# Altium project mod_duo_dwarf.PrjPcb (part 2 of 2)

## Sheet [4]-MECH_BUTTONS.SchDoc: [4]-MECH_BUTTONS
size A3; DocumentNumber: 4; Revision: 01-01-2020; SheetNumber: 4; SheetTotal: 6
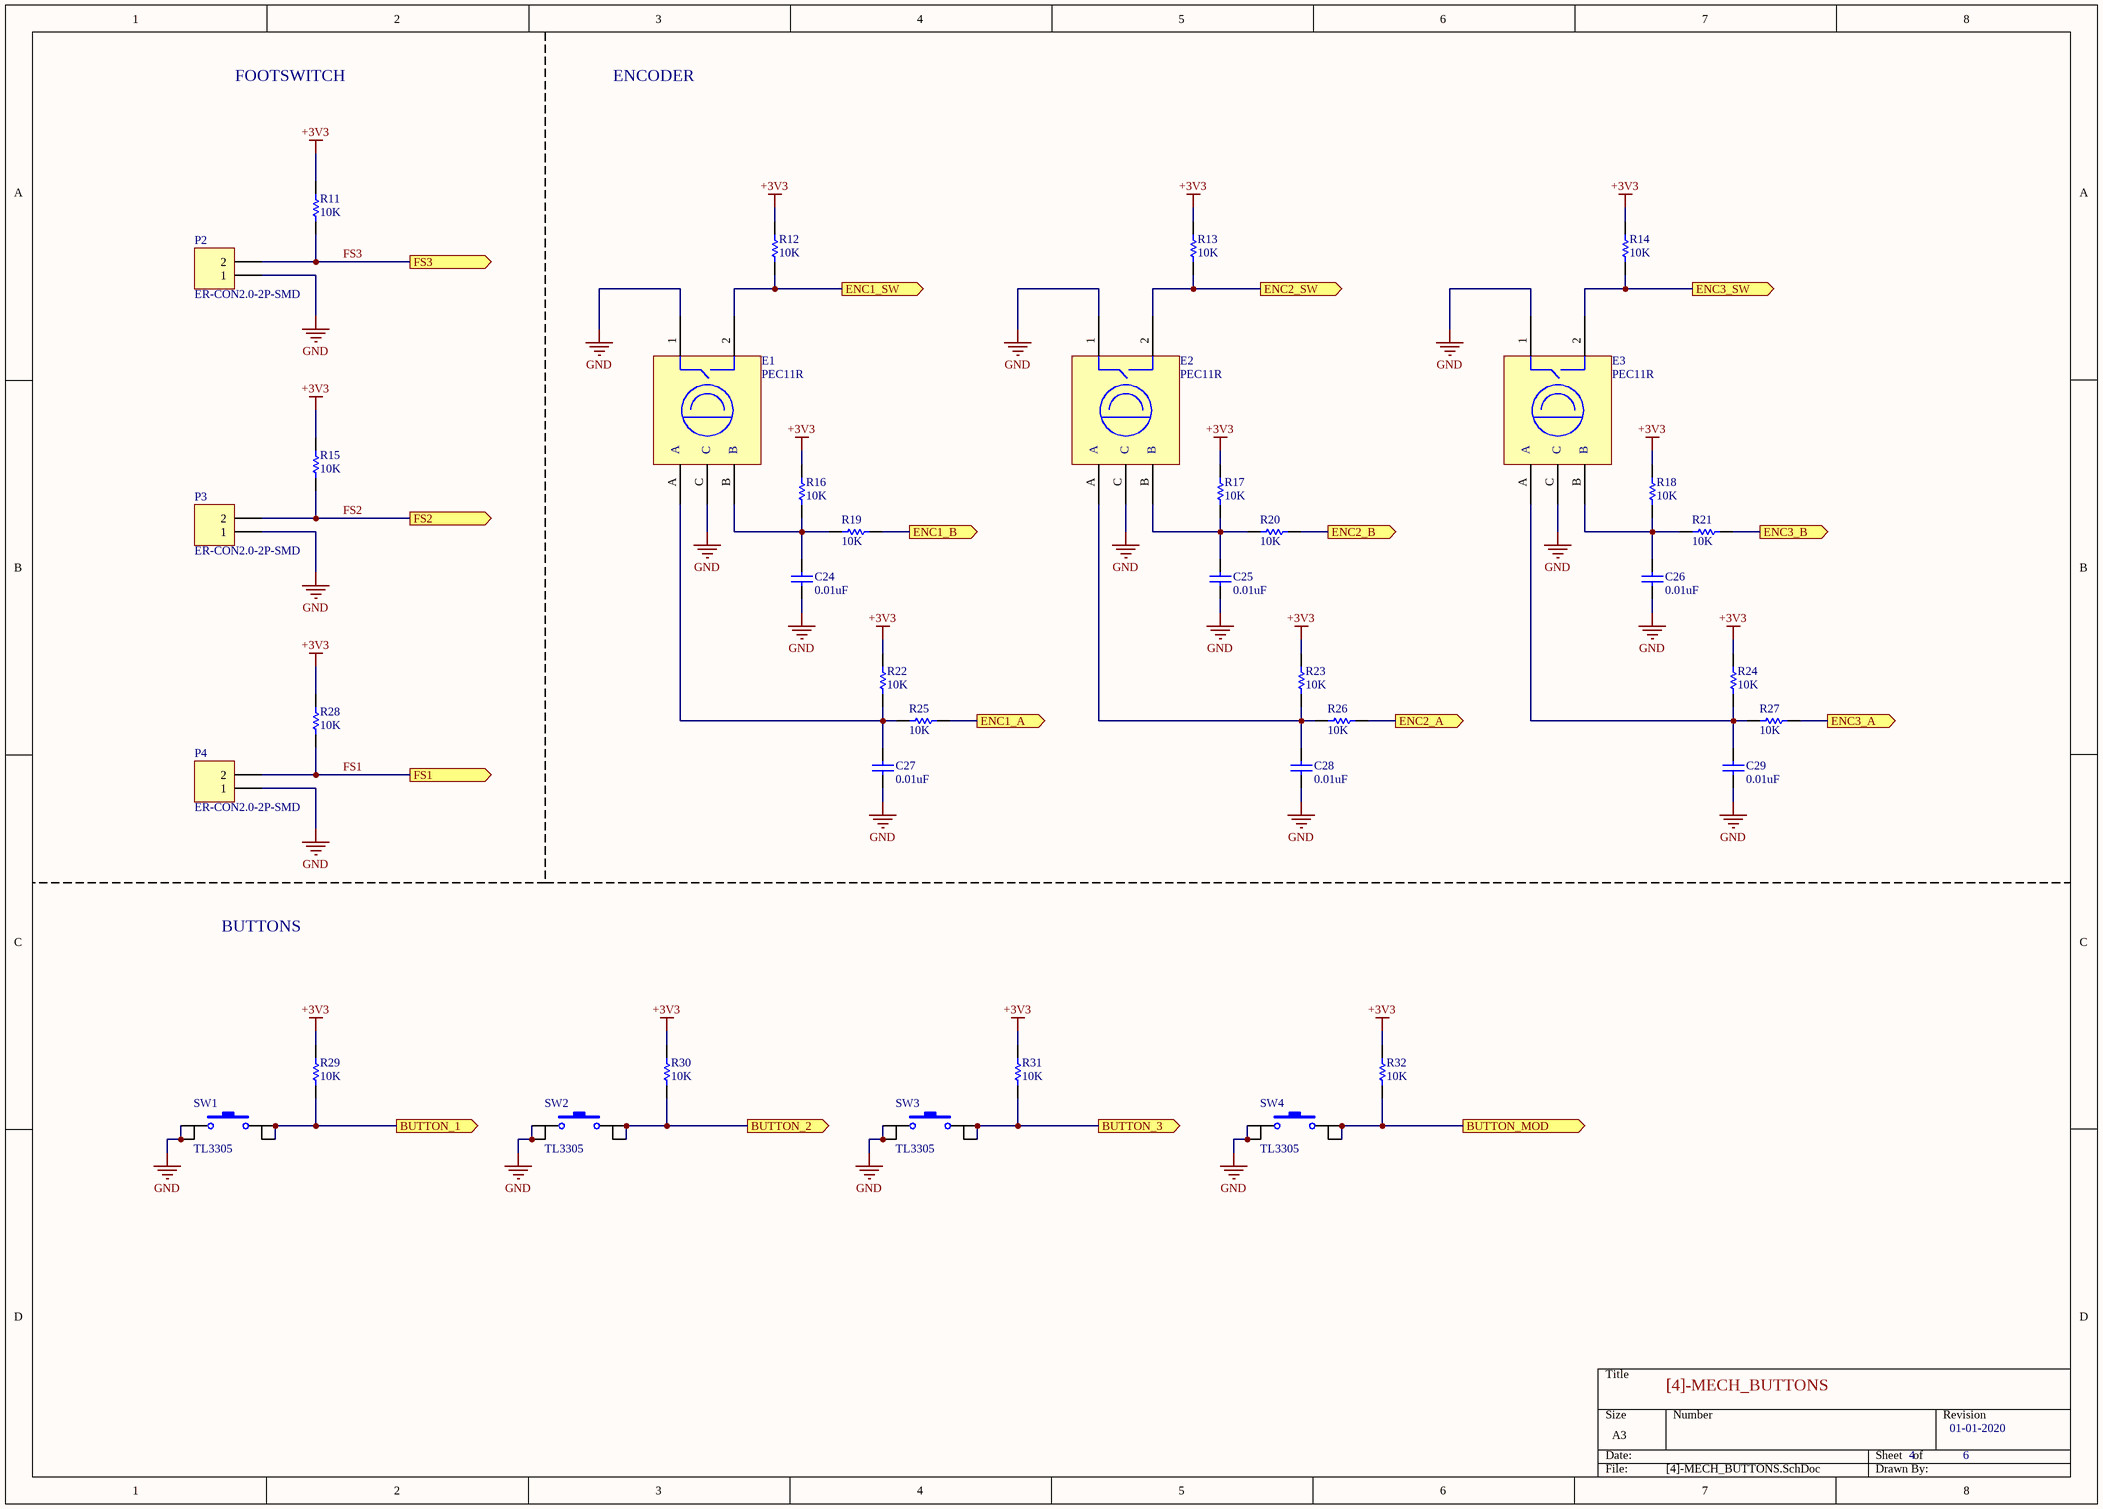
[diagram p3: [4]-MECH_BUTTONS.SchDoc]

### Parts
C24  0.01uF  [CAPC1608N]
C25  0.01uF  [CAPC1608N]
C26  0.01uF  [CAPC1608N]
C27  0.01uF  [CAPC1608N]
C28  0.01uF  [CAPC1608N]
C29  0.01uF  [CAPC1608N]
E1  PEC11R  [PEC11R]
E2  PEC11R  [PEC11R]
E3  PEC11R  [PEC11R]
P2  ER-CON2.0-2P-SMD  [ER-CON2.0-2P-SMD]
P3  ER-CON2.0-2P-SMD  [ER-CON2.0-2P-SMD]
P4  ER-CON2.0-2P-SMD  [ER-CON2.0-2P-SMD]
R11  10K  [RESC1608N]
R12  10K  [RESC1608N]
R13  10K  [RESC1608N]
R14  10K  [RESC1608N]
R15  10K  [RESC1608N]
R16  10K  [RESC1608N]
R17  10K  [RESC1608N]
R18  10K  [RESC1608N]
R19  10K  [RESC1608N]
R20  10K  [RESC1608N]
R21  10K  [RESC1608N]
R22  10K  [RESC1608N]
R23  10K  [RESC1608N]
R24  10K  [RESC1608N]
R25  10K  [RESC1608N]
R26  10K  [RESC1608N]
R27  10K  [RESC1608N]
R28  10K  [RESC1608N]
R29  10K  [RESC1608N]
R30  10K  [RESC1608N]
R31  10K  [RESC1608N]
R32  10K  [RESC1608N]
SW1  TL3305  [TL3305]
SW2  TL3305  [TL3305]
SW3  TL3305  [TL3305]
SW4  TL3305  [TL3305]

### Ports
BUTTON_1 (out), BUTTON_2 (out), BUTTON_3 (out), BUTTON_MOD (out), ENC1_A (out), ENC1_B (out), ENC1_SW (out), ENC2_A (out), ENC2_B (out), ENC2_SW (out), ENC3_A (out), ENC3_B (out), ENC3_SW (out), FS1 (out), FS2 (out), FS3 (out)

### Nets
+3V3: R11.1 R12.2 R13.2 R14.2 R15.1 R16.2 R17.2 R18.2 R22.2 R23.2 R24.2 R28.1 R29.2 R30.2 R31.2 R32.2
GND: C24.1 C25.1 C26.1 C27.1 C28.1 C29.1 E1.1 E1.C E2.1 E2.C E3.1 E3.C P2.1 P3.1 P4.1 SW1.1 SW1.2 SW2.1 SW2.2 SW3.1 SW3.2 SW4.1 SW4.2
BUTTON_1: R29.1 SW1.3 SW1.4 ; port BUTTON_1
BUTTON_2: R30.1 SW2.3 SW2.4 ; port BUTTON_2
BUTTON_3: R31.1 SW3.3 SW3.4 ; port BUTTON_3
BUTTON_MOD: R32.1 SW4.3 SW4.4 ; port BUTTON_MOD
ENC1_A: R25.1 ; port ENC1_A
ENC1_B: R19.1 ; port ENC1_B
ENC1_SW: E1.2 R12.1 ; port ENC1_SW
ENC2_A: R26.1 ; port ENC2_A
ENC2_B: R20.1 ; port ENC2_B
ENC2_SW: E2.2 R13.1 ; port ENC2_SW
ENC3_A: R27.1 ; port ENC3_A
ENC3_B: R21.1 ; port ENC3_B
ENC3_SW: E3.2 R14.1 ; port ENC3_SW
FS1: P4.2 R28.2 ; port FS1
FS2: P3.2 R15.2 ; port FS2
FS3: P2.2 R11.2 ; port FS3
NetC24_2: C24.2 E1.B R16.1 R19.2
NetC25_2: C25.2 E2.B R17.1 R20.2
NetC26_2: C26.2 E3.B R18.1 R21.2
NetC27_2: C27.2 E1.A R22.1 R25.2
NetC28_2: C28.2 E2.A R23.1 R26.2
NetC29_2: C29.2 E3.A R24.1 R27.2

### Notes on the sheet
- FOOTSWITCH
- ENCODER
- BUTTONS

### Library data of the parts
C24-C29 = 06035C-103KAT2A: CAP CER 10000PF 50V X7R 0603; Manufacturer 1: Kyocera AVX; Dielectric Material: Ceramic; Tolerance: 10%; Capacitance: 10nF; Dissipation Factor: 2.5%; Insulation Resistance: 100GR; Supplier 1: Digi-Key; Manufacturer Part Number 1: 06035C-103KAT2A; Stock 1: 40000; Pricing 1: 1=0.1, 10=0.075, 100=0.0334, 500=0.02388, 1000=0.01877 (USD); Mount: Surface Mount,PCB; Case/Package: 0603; Number of Pins: 2; Case Code (Metric): 1608; Case Code (Imperial): 0603; Contact Plating: Tin,Matte; Min Operating Temperature: -55°C; Max Operating Temperature: 125°C; Dielectric: X7R; Voltage Rating (DC): 50V; Packaging: Tape and Reel; Voltage: 50V; Voltage Rating: 50V; Package Quantity: 1; Termination: SMD/SMT; Length: 1.6mm; Height: 0.9mm; Width: 0.032inch; Depth: 0.81mm; Thickness: 0.035inch; Radiation Hardening: No; REACH SVHC: No SVHC; Lead Free: Lead Free; ComponentLink1URL: https://datasheet.ciiva.com/1124/1679506-1124848.pdf; ComponentLink1Description: https://datasheet.ciiva.com/1124/1679506-1124848.pdf; ComponentLink2URL: https://datasheet.ciiva.com/2987/cx7r-2987824.pdf; ComponentLink2Description: https://datasheet.ciiva.com/2987/cx7r-2987824.pdf; ComponentLink3URL: https://datasheet.ciiva.com/150/cx7r-150227.pdf; ComponentLink3Description: https://datasheet.ciiva.com/150/cx7r-150227.pdf; ComponentLink4URL: https://datasheet.ciiva.com/150/cx7r-150228.pdf; ComponentLink4Description: https://datasheet.ciiva.com/150/cx7r-150228.pdf; ComponentLink5URL: https://datasheet.ciiva.com/150/cx7r-150229.pdf; ComponentLink5Description: https://datasheet.ciiva.com/150/cx7r-150229.pdf; ComponentLink6URL: https://datasheet.ciiva.com/16209/cx7r-16209238.pdf; ComponentLink6Description: https://datasheet.ciiva.com/16209/cx7r-16209238.pdf; ComponentLink7URL: https://datasheet.ciiva.com/15212/getdatasheetpartid-87506-15212295.pdf; ComponentLink7Description: https://datasheet.ciiva.com/15212/getdatasheetpartid-87506-15212295.pdf; ComponentLink8URL: https://datasheet.ciiva.com/5423/cx7r-218113-5423178.pdf; ComponentLink8Description: https://datasheet.ciiva.com/5423/cx7r-218113-5423178.pdf; ComponentLink9URL: https://datasheet.ciiva.com/7855/1679506-7855082.pdf; ComponentLink9Description: https://datasheet.ciiva.com/7855/1679506-7855082.pdf; ComponentLink10URL: https://datasheet.ciiva.com/14585/70001075-14585146.pdf; ComponentLink10Description: https://datasheet.ciiva.com/14585/70001075-14585146.pdf; ComponentLink11URL: https://datasheet.ciiva.com/25901/cx7r-25901100.pdf; ComponentLink11Description: https://datasheet.ciiva.com/25901/cx7r-25901100.pdf; ComponentLink12URL: https://datasheet.ciiva.com/1124/1679506-1124847.pdf; ComponentLink12Description: https://datasheet.ciiva.com/1124/1679506-1124847.pdf; ComponentLink13URL: https://datasheet.ciiva.com/2987/cx7r-2987823.pdf; ComponentLink13Description: https://datasheet.ciiva.com/2987/cx7r-2987823.pdf; Supplier Part Number 1: 478-1227-1-ND
E1-E3 = PEC11R-4215F-S0024: ENCODER ROTARY 15MM SHAFT; Manufacturer 1: Bourns; Number of Channels: 2; Encoder Type: Mechanical; Pulses per Revolution: 24; Detent: Yes; Output Type: Quadrature,Incremental; Hole Diameter: 1.8mm; Supplier 1: Digi-Key; Manufacturer Part Number 1: PEC11R-4215F-S0024; Stock 1: 2746; Pricing 1: 1=1.68, 10=1.566, 25=1.4792, 50=1.305, 150=1.073, 300=1.044, 600=0.986, 1050=0.928, 5100=0.812 (USD); Mount: Through Hole,Panel,PCB; Min Operating Temperature: -30°C; Max Operating Temperature: 70°C; Package Quantity: 150; Packaging: Bulk; Termination: PC Pins; Orientation: Vertical; Built in Switch: Yes; Type: Mechanical; Length: 21.5mm; Height: 13.4mm; Width: 12.5mm; Radiation Hardening: No; REACH SVHC: No SVHC; ComponentLink1URL: https://datasheet.ciiva.com/26917/getdatasheetpartid-730131-26917851.pdf; ComponentLink1Description: https://datasheet.ciiva.com/26917/getdatasheetpartid-730131-26917851.pdf; ComponentLink2URL: https://datasheet.ciiva.com/12175/pec11r-221203-12175422.pdf; ComponentLink2Description: https://datasheet.ciiva.com/12175/pec11r-221203-12175422.pdf; Supplier Part Number 1: PEC11R-4215F-S0024-ND
P2-P4 = ER-CON2.0-2P-SMD: CONN 2 POS SMD 2MM PITCH
R11-R32 = AC0603JR-0710KL: RES SMD 10K OHM 5% 1/10W 0603; Manufacturer 1: Yageo; Voltage Rating: 50V; Resistance: 10kR; Power Rating: 100mW; Temperature Coefficient: 100ppm/°C; Supplier 1: Digi-Key; Manufacturer Part Number 1: AC0603JR-0710KL; Stock 1: 60451; Pricing 1: 1=0.1, 10=0.032, 100=0.0131, 1000=0.00588, 2500=0.0051 (USD); Case/Package: 0603; Case Code (Imperial): 0603; Case Code (Metric): 1608; Min Operating Temperature: -55°C; Max Operating Temperature: 155°C; Packaging: Tape and Reel; Tolerance: 5%; Package Quantity: 1; Composition: Thick Film; Termination: SMD/SMT; Number of Terminations: 2; Military Standard: Not; Max Power Dissipation: 100mW; Features: Moisture Resistant,Automotive AEC-Q200,Anti-Sulfur; Length: 0.063inch; Height: 0.022inch; Width: 0.031inch; Depth: 0.8mm; Lead Free: Lead Free; ComponentLink1URL: https://datasheet.ciiva.com/5562/pyu-ac-51-rohs-l-2-5562553.pdf; ComponentLink1Description: https://datasheet.ciiva.com/5562/pyu-ac-51-rohs-l-2-5562553.pdf; Supplier Part Number 1: 311-10KLECT-ND
SW1-SW4 = TL3305AF160QG: SWITCH TACTILE SPST-NO 50MA 12V; Manufacturer 1: E-Switch; Mechanical Life: 500000Cycles; Illumination Type: Non-Illuminated; Operating Force: 160gf; Throw Configuration: SPST; Switch Travel: 0.2mm; Switch Function: Off-Mom; Supplier 1: Digi-Key; Manufacturer Part Number 1: TL3305AF160QG; Stock 1: 67156; Pricing 1: 1=0.22, 10=0.217, 25=0.2096, 50=0.202, 100=0.1907, 250=0.17952, 500=0.17204, 1000=0.1309 (USD); Mount: Surface Mount; Min Operating Temperature: -20°C; Max Operating Temperature: 70°C; Packaging: Tape and Reel; Termination: Gull Wing; Lead Free: Lead Free; Supplier Part Number 1: EG5350CT-ND

## Sheet [5]-BUTTONS_ILLUMINATION.SchDoc: [5]-BUTTONS_ILLUMINATION
size A3; DocumentNumber: 5; Revision: 01-01-2020; SheetNumber: 5; SheetTotal: 6
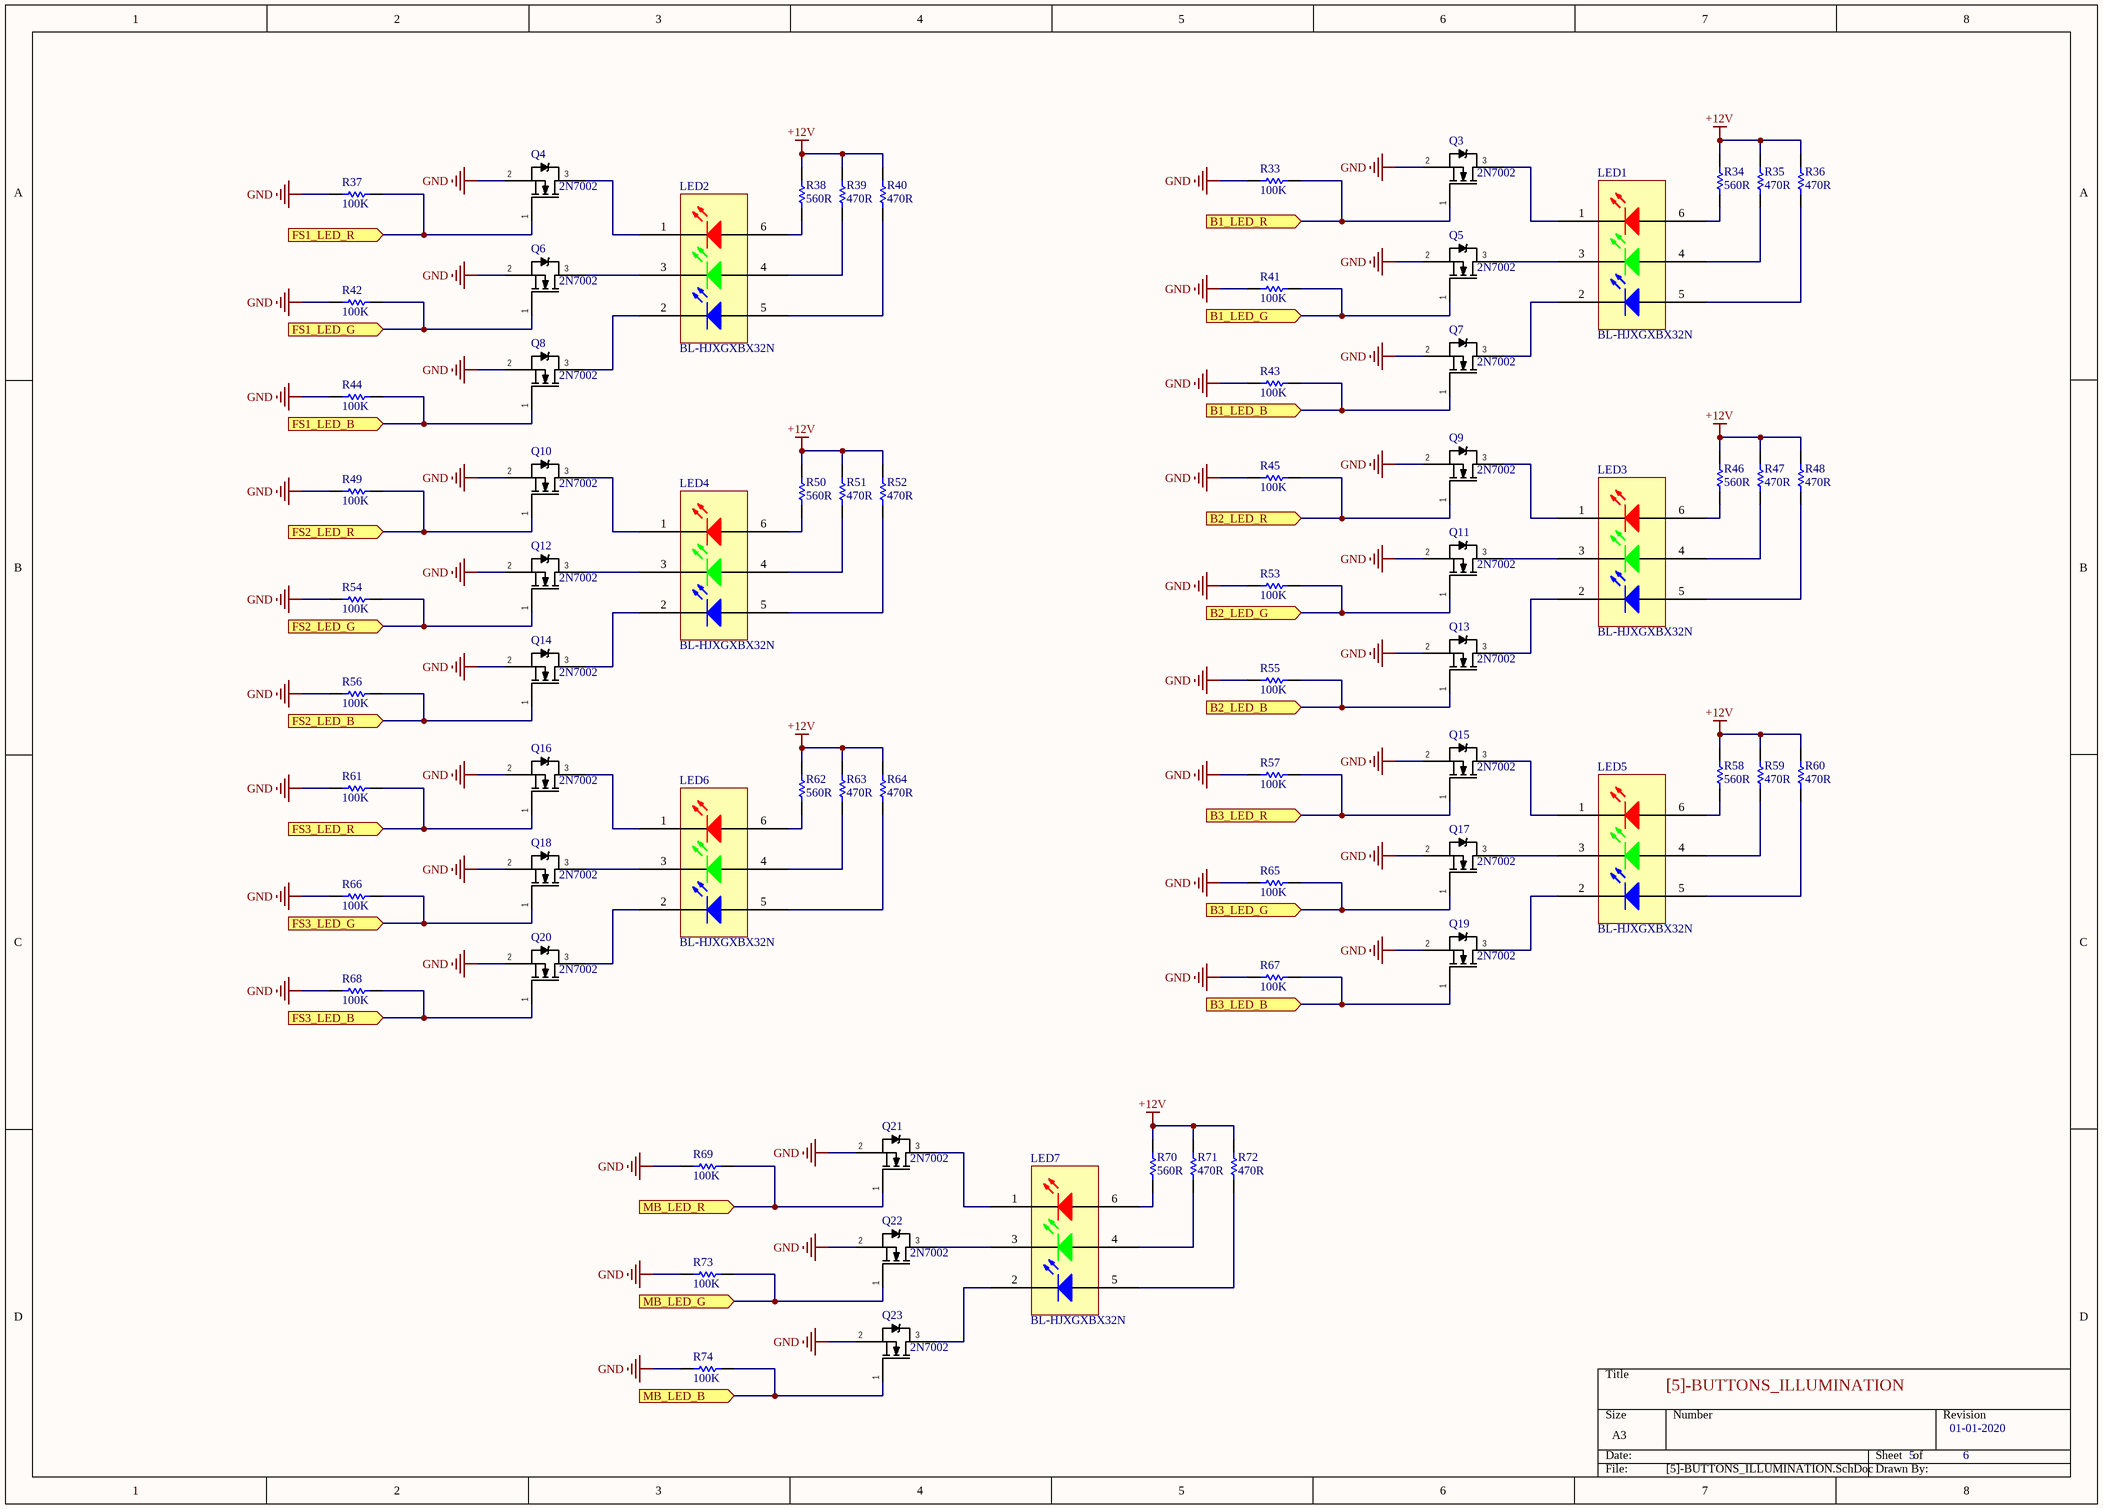
[diagram p4: [5]-BUTTONS_ILLUMINATION.SchDoc]

### Parts
LED1  BL-HJXGXBX32N  [BL-HJXGXBX32N]
LED2  BL-HJXGXBX32N  [BL-HJXGXBX32N]
LED3  BL-HJXGXBX32N  [BL-HJXGXBX32N]
LED4  BL-HJXGXBX32N  [BL-HJXGXBX32N]
LED5  BL-HJXGXBX32N  [BL-HJXGXBX32N]
LED6  BL-HJXGXBX32N  [BL-HJXGXBX32N]
LED7  BL-HJXGXBX32N  [BL-HJXGXBX32N]
Q3  2N7002  [SOT23-3N]
Q4  2N7002  [SOT23-3N]
Q5  2N7002  [SOT23-3N]
Q6  2N7002  [SOT23-3N]
Q7  2N7002  [SOT23-3N]
Q8  2N7002  [SOT23-3N]
Q9  2N7002  [SOT23-3N]
Q10  2N7002  [SOT23-3N]
Q11  2N7002  [SOT23-3N]
Q12  2N7002  [SOT23-3N]
Q13  2N7002  [SOT23-3N]
Q14  2N7002  [SOT23-3N]
Q15  2N7002  [SOT23-3N]
Q16  2N7002  [SOT23-3N]
Q17  2N7002  [SOT23-3N]
Q18  2N7002  [SOT23-3N]
Q19  2N7002  [SOT23-3N]
Q20  2N7002  [SOT23-3N]
Q21  2N7002  [SOT23-3N]
Q22  2N7002  [SOT23-3N]
Q23  2N7002  [SOT23-3N]
R33  100K  [RESC1608N]
R34  560R  [RESC1608N]
R35  470R  [RESC1608N]
R36  470R  [RESC1608N]
R37  100K  [RESC1608N]
R38  560R  [RESC1608N]
R39  470R  [RESC1608N]
R40  470R  [RESC1608N]
R41  100K  [RESC1608N]
R42  100K  [RESC1608N]
R43  100K  [RESC1608N]
R44  100K  [RESC1608N]
R45  100K  [RESC1608N]
R46  560R  [RESC1608N]
R47  470R  [RESC1608N]
R48  470R  [RESC1608N]
R49  100K  [RESC1608N]
R50  560R  [RESC1608N]
R51  470R  [RESC1608N]
R52  470R  [RESC1608N]
R53  100K  [RESC1608N]
R54  100K  [RESC1608N]
R55  100K  [RESC1608N]
R56  100K  [RESC1608N]
R57  100K  [RESC1608N]
R58  560R  [RESC1608N]
R59  470R  [RESC1608N]
R60  470R  [RESC1608N]
R61  100K  [RESC1608N]
R62  560R  [RESC1608N]
R63  470R  [RESC1608N]
R64  470R  [RESC1608N]
R65  100K  [RESC1608N]
R66  100K  [RESC1608N]
R67  100K  [RESC1608N]
R68  100K  [RESC1608N]
R69  100K  [RESC1608N]
R70  560R  [RESC1608N]
R71  470R  [RESC1608N]
R72  470R  [RESC1608N]
R73  100K  [RESC1608N]
R74  100K  [RESC1608N]

### Ports
B1_LED_B (in), B1_LED_G (in), B1_LED_R (in), B2_LED_B (in), B2_LED_G (in), B2_LED_R (in), B3_LED_B (in), B3_LED_G (in), B3_LED_R (in), FS1_LED_B (in), FS1_LED_G (in), FS1_LED_R (in), FS2_LED_B (in), FS2_LED_G (in), FS2_LED_R (in), FS3_LED_B (in), FS3_LED_G (in), FS3_LED_R (in), MB_LED_B (in), MB_LED_G (in), MB_LED_R (in)

### Nets
+12V: R34.2 R35.2 R36.2 R38.2 R39.2 R40.2 R46.2 R47.2 R48.2 R50.2 R51.2 R52.2 R58.2 R59.2 R60.2 R62.2 R63.2 R64.2 R70.2 R71.2 R72.2
GND: Q3.2(S) Q4.2(S) Q5.2(S) Q6.2(S) Q7.2(S) Q8.2(S) Q9.2(S) Q10.2(S) Q11.2(S) Q12.2(S) Q13.2(S) Q14.2(S) Q15.2(S) Q16.2(S) Q17.2(S) Q18.2(S) Q19.2(S) Q20.2(S) Q21.2(S) Q22.2(S) Q23.2(S) R33.2 R37.2 R41.2 R42.2 R43.2 R44.2 R45.2 R49.2 R53.2 R54.2 R55.2 R56.2 R57.2 R61.2 R65.2 R66.2 R67.2 R68.2 R69.2 R73.2 R74.2
B1_LED_B: Q7.1(G) R43.1 ; port B1_LED_B
B1_LED_G: Q5.1(G) R41.1 ; port B1_LED_G
B1_LED_R: Q3.1(G) R33.1 ; port B1_LED_R
B2_LED_B: Q13.1(G) R55.1 ; port B2_LED_B
B2_LED_G: Q11.1(G) R53.1 ; port B2_LED_G
B2_LED_R: Q9.1(G) R45.1 ; port B2_LED_R
B3_LED_B: Q19.1(G) R67.1 ; port B3_LED_B
B3_LED_G: Q17.1(G) R65.1 ; port B3_LED_G
B3_LED_R: Q15.1(G) R57.1 ; port B3_LED_R
FS1_LED_B: Q8.1(G) R44.1 ; port FS1_LED_B
FS1_LED_G: Q6.1(G) R42.1 ; port FS1_LED_G
FS1_LED_R: Q4.1(G) R37.1 ; port FS1_LED_R
FS2_LED_B: Q14.1(G) R56.1 ; port FS2_LED_B
FS2_LED_G: Q12.1(G) R54.1 ; port FS2_LED_G
FS2_LED_R: Q10.1(G) R49.1 ; port FS2_LED_R
FS3_LED_B: Q20.1(G) R68.1 ; port FS3_LED_B
FS3_LED_G: Q18.1(G) R66.1 ; port FS3_LED_G
FS3_LED_R: Q16.1(G) R61.1 ; port FS3_LED_R
MB_LED_B: Q23.1(G) R74.1 ; port MB_LED_B
MB_LED_G: Q22.1(G) R73.1 ; port MB_LED_G
MB_LED_R: Q21.1(G) R69.1 ; port MB_LED_R
NetLED1_1: LED1.1 Q3.3(D)
NetLED1_2: LED1.2 Q7.3(D)
NetLED1_3: LED1.3 Q5.3(D)
NetLED1_4: LED1.4 R35.1
NetLED1_5: LED1.5 R36.1
NetLED1_6: LED1.6 R34.1
NetLED2_1: LED2.1 Q4.3(D)
NetLED2_2: LED2.2 Q8.3(D)
NetLED2_3: LED2.3 Q6.3(D)
NetLED2_4: LED2.4 R39.1
NetLED2_5: LED2.5 R40.1
NetLED2_6: LED2.6 R38.1
NetLED3_1: LED3.1 Q9.3(D)
NetLED3_2: LED3.2 Q13.3(D)
NetLED3_3: LED3.3 Q11.3(D)
NetLED3_4: LED3.4 R47.1
NetLED3_5: LED3.5 R48.1
NetLED3_6: LED3.6 R46.1
NetLED4_1: LED4.1 Q10.3(D)
NetLED4_2: LED4.2 Q14.3(D)
NetLED4_3: LED4.3 Q12.3(D)
NetLED4_4: LED4.4 R51.1
NetLED4_5: LED4.5 R52.1
NetLED4_6: LED4.6 R50.1
NetLED5_1: LED5.1 Q15.3(D)
NetLED5_2: LED5.2 Q19.3(D)
NetLED5_3: LED5.3 Q17.3(D)
NetLED5_4: LED5.4 R59.1
NetLED5_5: LED5.5 R60.1
NetLED5_6: LED5.6 R58.1
NetLED6_1: LED6.1 Q16.3(D)
NetLED6_2: LED6.2 Q20.3(D)
NetLED6_3: LED6.3 Q18.3(D)
NetLED6_4: LED6.4 R63.1
NetLED6_5: LED6.5 R64.1
NetLED6_6: LED6.6 R62.1
NetLED7_1: LED7.1 Q21.3(D)
NetLED7_2: LED7.2 Q23.3(D)
NetLED7_3: LED7.3 Q22.3(D)
NetLED7_4: LED7.4 R71.1
NetLED7_5: LED7.5 R72.1
NetLED7_6: LED7.6 R70.1

### Library data of the parts
LED1-LED7 = BL-HJXGXBX32N: LED RGB 6PLCC SMD; Manufacturer 1: American Bright; Supplier 1: Digi-Key; Manufacturer Part Number 1: BL-HJXGXBX32N; Stock 1: 23855; Pricing 1: 1=0.59000, 10=0.42700, 100=0.27880, 500=0.20040, 1000=0.15683 (USD); RoHS: No; Packaging: Cut Tape; Supplier Part Number 1: BL-HJXGXBX32NCT-ND
Q3-Q23 = 2N7002: MOSFET N-CH 60V 115MA SOT-23; Manufacturer 1: ON Semiconductor / Fairchild; Max Power Dissipation: 200mW; Drain to Source Resistance: 1.2R; Gate to Source Voltage (Vgs): 20V; Nominal Vgs: 2.1V; Number of Elements: 1; Element Configuration: Single; Input Capacitance: 50pF; Rds On Max: 7.5R; On-State Resistance: 5.3R; Supplier 1: Digi-Key; Manufacturer Part Number 1: 2N7002; Stock 1: 111118; Pricing 1: 1=0.33, 10=0.304, 100=0.17, 500=0.09108, 1000=0.06193 (USD); Mount: Surface Mount; Case/Package: SOT-23; Number of Pins: 3; Contact Plating: Tin,Matte; Min Operating Temperature: -55°C; Max Operating Temperature: 150°C; Continuous Drain Current (ID): 115mA; Packaging: Tape and Reel; Package Quantity: 1; Drain to Source Voltage (Vdss): 60V; Drain to Source Breakdown Voltage: 60V; Power Dissipation: 200mW; Threshold Voltage: 2.1V; Voltage Rating (DC): 60V; Current Rating: 115mA; Dual Supply Voltage: 60V; Current: 115mA; Voltage: 60V; Length: 2.92mm; Height: 0.93mm; Width: 3.05mm; Radiation Hardening: No; REACH SVHC: No SVHC; Lead Free: Lead Free; ComponentLink1URL: https://datasheet.ciiva.com/931/2n7000-931777.pdf; ComponentLink1Description: https://datasheet.ciiva.com/931/2n7000-931777.pdf; ComponentLink2URL: https://datasheet.ciiva.com/27746/47-0120-27746881.pdf; ComponentLink2Description: https://datasheet.ciiva.com/27746/47-0120-27746881.pdf; ComponentLink3URL: https://datasheet.ciiva.com/1254/2n7002-1254451.pdf; ComponentLink3Description: https://datasheet.ciiva.com/1254/2n7002-1254451.pdf; ComponentLink4URL: https://datasheet.ciiva.com/15137/getdatasheetpartid-93547-15137771.pdf; ComponentLink4Description: https://datasheet.ciiva.com/15137/getdatasheetpartid-93547-15137771.pdf; ComponentLink5URL: https://datasheet.ciiva.com/931/2n7000-931762.pdf; ComponentLink5Description: https://datasheet.ciiva.com/931/2n7000-931762.pdf; ComponentLink6URL: https://datasheet.ciiva.com/931/2n7000-931763.pdf; ComponentLink6Description: https://datasheet.ciiva.com/931/2n7000-931763.pdf; ComponentLink7URL: https://datasheet.ciiva.com/931/2n7000-931764.pdf; ComponentLink7Description: https://datasheet.ciiva.com/931/2n7000-931764.pdf; ComponentLink8URL: https://datasheet.ciiva.com/1254/660093-1254452.pdf; ComponentLink8Description: https://datasheet.ciiva.com/1254/660093-1254452.pdf; ComponentLink9URL: https://datasheet.ciiva.com/1188/660093-1188359.pdf; ComponentLink9Description: https://datasheet.ciiva.com/1188/660093-1188359.pdf; ComponentLink10URL: https://datasheet.ciiva.com/1188/660093-1188361.pdf; ComponentLink10Description: https://datasheet.ciiva.com/1188/660093-1188361.pdf; ComponentLink11URL: https://datasheet.ciiva.com/17007/2n7002-17007243.pdf; ComponentLink11Description: https://datasheet.ciiva.com/17007/2n7002-17007243.pdf; ComponentLink12URL: https://datasheet.ciiva.com/3304/nds7002a-3304380.pdf; ComponentLink12Description: https://datasheet.ciiva.com/3304/nds7002a-3304380.pdf; ComponentLink13URL: https://datasheet.ciiva.com/3304/nds7002a-3304381.pdf; ComponentLink13Description: https://datasheet.ciiva.com/3304/nds7002a-3304381.pdf; ComponentLink14URL: https://datasheet.ciiva.com/22655/660093-22655230.pdf; ComponentLink14Description: https://datasheet.ciiva.com/22655/660093-22655230.pdf; Supplier Part Number 1: 2N7002NCT-ND
R33 R37 R41-R45 R49 R53-R57 R61 R65-R69 R73 R74 = ESR03EZPJ104: RES SMD 100K OHM 5% 1/4W 0603; Manufacturer 1: Rohm; Resistance: 100kR; Power Rating: 200mW; Max Power Dissipation: 250mW; Temperature Coefficient: 200ppm/°C; Supplier 1: Digi-Key; Manufacturer Part Number 1: ESR03EZPJ104; Stock 1: 17901; Pricing 1: 1=0.1, 10=0.087, 100=0.0333, 1000=0.01464, 2500=0.01264 (USD); Case/Package: 0603; Case Code (Metric): 1608; Case Code (Imperial): 0603; Min Operating Temperature: -55°C; Max Operating Temperature: 155°C; Tolerance: 5%; Package Quantity: 1; Packaging: Cut Tape; Composition: Thick Film; Number of Terminations: 2; Length: 0.063inch; Height: 0.022inch; Width: 0.031inch; Lead Free: Lead Free; ComponentLink1URL: https://datasheet.ciiva.com/14930/esr-14930633.pdf; ComponentLink1Description: https://datasheet.ciiva.com/14930/esr-14930633.pdf; ComponentLink2URL: https://datasheet.ciiva.com/14924/esr-14924811.pdf; ComponentLink2Description: https://datasheet.ciiva.com/14924/esr-14924811.pdf; ComponentLink3URL: https://datasheet.ciiva.com/14928/esr-14928813.pdf; ComponentLink3Description: https://datasheet.ciiva.com/14928/esr-14928813.pdf; Supplier Part Number 1: RHM100KDCT-ND
R34 R38 R46 R50 R58 R62 R70 = AC0603JR-07560RL: RES SMD 560 OHM 5% 1/10W 0603; Manufacturer 1: Yageo; Power Rating: 100mW; Voltage Rating: 50V; Temperature Coefficient: 100ppm/°C; Supplier 1: Digi-Key; Manufacturer Part Number 1: AC0603JR-07560RL; Stock 1: 24630; Pricing 1: 1=0.1, 10=0.026, 100=0.0107, 1000=0.00478, 2500=0.00415 (USD); Case/Package: 0603; Case Code (Imperial): 0603; Case Code (Metric): 1608; Min Operating Temperature: -55°C; Max Operating Temperature: 155°C; Packaging: Tape and Reel; Resistance: 560R; Tolerance: 5%; Composition: Thick Film; Number of Terminations: 2; Termination: SMD/SMT; Max Power Dissipation: 100mW; Length: 0.063inch; Height: 0.022inch; Width: 0.031inch; ComponentLink1URL: http://www.yageo.com/NewPortal/yageodocoutput?fileName=/pdf/R-Chip/PYu-AC_51_RoHS_L_6.pdf; ComponentLink1Description: http://www.yageo.com/NewPortal/yageodocoutput?fileName=/pdf/R-Chip/PYu-AC_51_RoHS_L_6.pdf; ComponentLink2URL: http://www.mouser.com/ds/2/447/yageodocoutput-1111992.pdf; ComponentLink2Description: http://www.mouser.com/ds/2/447/yageodocoutput-1111992.pdf; Supplier Part Number 1: YAG3681CT-ND
R35 R36 R39 R40 R47 R48 R51 R52 R59 R60 R63 R64 R71 R72 = RMCF0603JT470R: RES SMD 470 OHM 5% 1/10W 0603; Manufacturer 1: Stackpole Electronics; Power Rating: 100mW; Temperature Coefficient: 100ppm/°C; Working Voltage: 75V; Supplier 1: Digi-Key; Manufacturer Part Number 1: RMCF0603JT470R; Stock 1: 1799; Pricing 1: 1=0.1, 10=0.013, 100=0.0051, 1000=0.0023, 2500=0.002 (USD); Mount: Surface Mount; Case/Package: 0603; Case Code (Metric): 1608; Case Code (Imperial): 0603; Contact Plating: Tin,Matte; Min Operating Temperature: -55°C; Max Operating Temperature: 155°C; Packaging: Tape and Reel; Resistance: 470R; Tolerance: 5%; Package Quantity: 1; Composition: Thick Film; Number of Terminations: 2; Military Standard: Not; Max Power Dissipation: 100mW; Features: Automotive AEC-Q200; Length: 1.55mm; Height: 0.022inch; Width: 0.031inch; Depth: 0.8mm; Radiation Hardening: No; Lead Free: Lead Free; ComponentLink1URL: https://datasheet.ciiva.com/15193/getdatasheetpartid-360691-15193516.pdf; ComponentLink1Description: https://datasheet.ciiva.com/15193/getdatasheetpartid-360691-15193516.pdf; Supplier Part Number 1: RMCF0603JT470RCT-ND

## Sheet [6]-PEAKMETER_LEDS.SchDoc: [6]-PEAKMETER_LEDS
size A3; DocumentNumber: 6; Revision: 01-01-2020; SheetNumber: 6; SheetTotal: 6
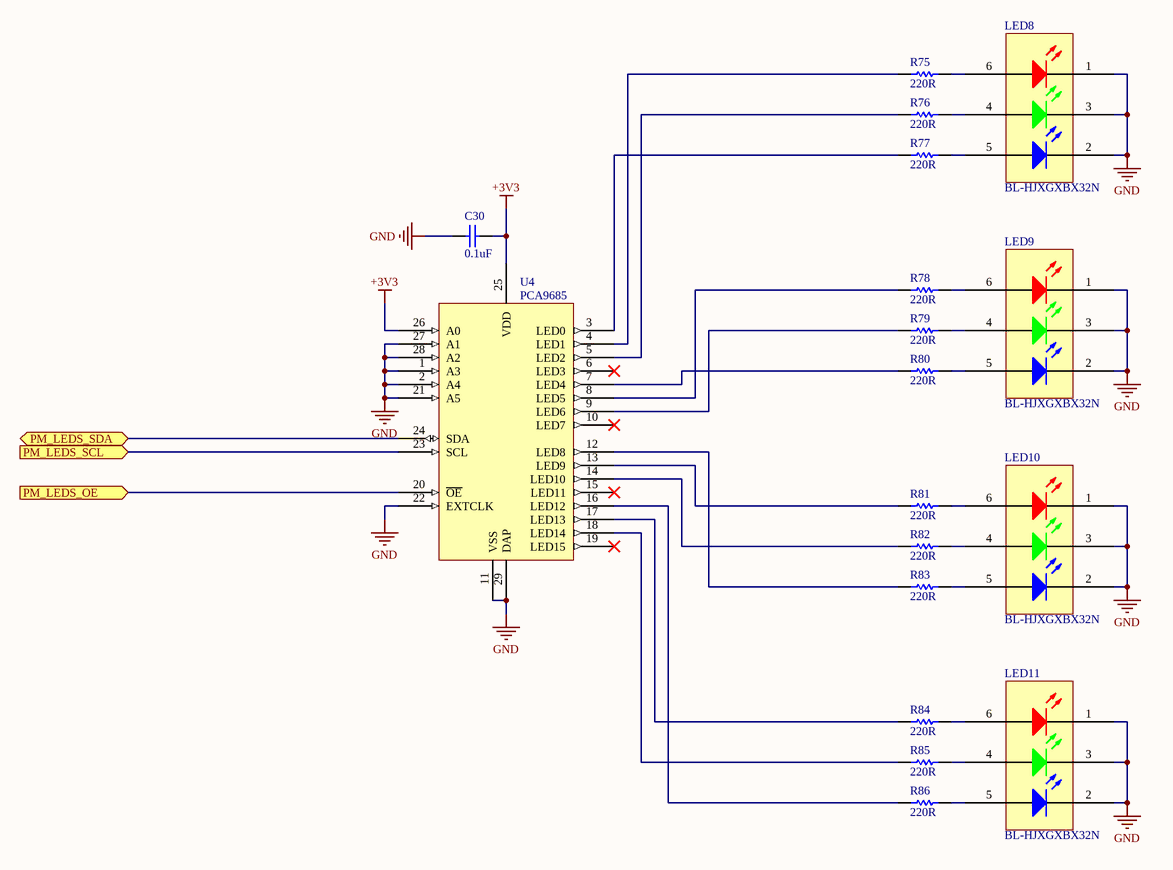
[diagram p5: [6]-PEAKMETER_LEDS.SchDoc]

### Parts
C30  0.1uF  [CAPC1608N]
LED8  BL-HJXGXBX32N  [BL-HJXGXBX32N]
LED9  BL-HJXGXBX32N  [BL-HJXGXBX32N]
LED10  BL-HJXGXBX32N  [BL-HJXGXBX32N]
LED11  BL-HJXGXBX32N  [BL-HJXGXBX32N]
R75  220R  [RESC1608N]
R76  220R  [RESC1608N]
R77  220R  [RESC1608N]
R78  220R  [RESC1608N]
R79  220R  [RESC1608N]
R80  220R  [RESC1608N]
R81  220R  [RESC1608N]
R82  220R  [RESC1608N]
R83  220R  [RESC1608N]
R84  220R  [RESC1608N]
R85  220R  [RESC1608N]
R86  220R  [RESC1608N]
U4  PCA9685  [SOT788-1]

### Ports
PM_LEDS_OE (in), PM_LEDS_SCL (in), PM_LEDS_SDA (bidir)

### Nets
+3V3: C30.1 U4.25(VDD) U4.26(A0)
GND: C30.2 LED8.1 LED8.2 LED8.3 LED9.1 LED9.2 LED9.3 LED10.1 LED10.2 LED10.3 LED11.1 LED11.2 LED11.3 U4.1(A3) U4.2(A4) U4.11(VSS) U4.21(A5) U4.22(EXTCLK) U4.27(A1) U4.28(A2) U4.29(DAP)
PM_LEDS_OE: U4.20(~{OE}) ; port PM_LEDS_OE
PM_LEDS_SCL: U4.23(SCL) ; port PM_LEDS_SCL
PM_LEDS_SDA: U4.24(SDA) ; port PM_LEDS_SDA
NetLED8_4: LED8.4 R76.2
NetLED8_5: LED8.5 R77.2
NetLED8_6: LED8.6 R75.2
NetLED9_4: LED9.4 R79.2
NetLED9_5: LED9.5 R80.2
NetLED9_6: LED9.6 R78.2
NetLED10_4: LED10.4 R82.2
NetLED10_5: LED10.5 R83.2
NetLED10_6: LED10.6 R81.2
NetLED11_4: LED11.4 R85.2
NetLED11_5: LED11.5 R86.2
NetLED11_6: LED11.6 R84.2
NetR75_1: R75.1 U4.4(LED1)
NetR76_1: R76.1 U4.5(LED2)
NetR77_1: R77.1 U4.3(LED0)
NetR78_1: R78.1 U4.8(LED5)
NetR79_1: R79.1 U4.9(LED6)
NetR80_1: R80.1 U4.7(LED4)
NetR81_1: R81.1 U4.13(LED9)
NetR82_1: R82.1 U4.14(LED10)
NetR83_1: R83.1 U4.12(LED8)
NetR84_1: R84.1 U4.17(LED13)
NetR85_1: R85.1 U4.18(LED14)
NetR86_1: R86.1 U4.16(LED12)

Not connected (* = marked no-connect by the designer): U4 6(LED3)* 10(LED7)* 15(LED11)* 19(LED15)*

### Library data of the parts
C30 = CC0603KRX7R8BB104: CAP CER 0.1UF 25V X7R 0603; Manufacturer 1: Yageo; Capacitance: 100nF; Tolerance: 10%; Supplier 1: Digi-Key; Manufacturer Part Number 1: CC0603KRX7R8BB104; Stock 1: 40000; Pricing 1: 1=0.1, 10=0.074, 100=0.0329, 500=0.02352, 1000=0.01848 (USD); Mount: Surface Mount; Case/Package: 0603; Number of Pins: 2; Case Code (Imperial): 0603; Case Code (Metric): 1608; Min Operating Temperature: -55°C; Max Operating Temperature: 125°C; Dielectric: X7R; Voltage Rating: 25V; Packaging: Tape and Reel; Package Quantity: 1; Voltage Rating (DC): 25V; Termination: SMD/SMT; Composition: Ceramic; Voltage: 25V; Length: 1.6mm; Height: 0.8mm; Width: 0.8mm; Thickness: 0.035inch; Depth: 0.8mm; Radiation Hardening: No; REACH SVHC: Unknown; Lead Free: Lead Free; Halogen Free: Halogen Free; ComponentLink1URL: https://datasheet.ciiva.com/11786/0900766b80c10176-11786120.pdf; ComponentLink1Description: https://datasheet.ciiva.com/11786/0900766b80c10176-11786120.pdf; ComponentLink2URL: https://datasheet.ciiva.com/144/mlccorderingcode-144075.pdf; ComponentLink2Description: https://datasheet.ciiva.com/144/mlccorderingcode-144075.pdf; ComponentLink3URL: https://datasheet.ciiva.com/17434/upy-gphc-x7r-6-3v-to-50v-8-17434263.pdf; ComponentLink3Description: https://datasheet.ciiva.com/17434/upy-gphc-x7r-6-3v-to-50v-8-17434263.pdf; ComponentLink4URL: https://datasheet.ciiva.com/26829/getdatasheetpartid-403577-26829431.pdf; ComponentLink4Description: https://datasheet.ciiva.com/26829/getdatasheetpartid-403577-26829431.pdf; ComponentLink5URL: https://datasheet.ciiva.com/11587/upy-gphc-x7r-6-3v-to-50v-8-11587208.pdf; ComponentLink5Description: https://datasheet.ciiva.com/11587/upy-gphc-x7r-6-3v-to-50v-8-11587208.pdf; ComponentLink6URL: https://datasheet.ciiva.com/13389/upy-gphc-x7r-6-3v-to-50v-8-13389352.pdf; ComponentLink6Description: https://datasheet.ciiva.com/13389/upy-gphc-x7r-6-3v-to-50v-8-13389352.pdf; ComponentLink7URL: https://datasheet.ciiva.com/28450/1489800-28450584.pdf; ComponentLink7Description: https://datasheet.ciiva.com/28450/1489800-28450584.pdf; ComponentLink8URL: https://datasheet.ciiva.com/144/mlccorderingcode-144073.pdf; ComponentLink8Description: https://datasheet.ciiva.com/144/mlccorderingcode-144073.pdf; ComponentLink9URL: https://datasheet.ciiva.com/144/mlccorderingcode-144074.pdf; ComponentLink9Description: https://datasheet.ciiva.com/144/mlccorderingcode-144074.pdf; ComponentLink10URL: https://datasheet.ciiva.com/7978/1489800-7978155.pdf; ComponentLink10Description: https://datasheet.ciiva.com/7978/1489800-7978155.pdf; Supplier Part Number 1: 311-1341-1-ND
LED8-LED11 = BL-HJXGXBX32N: as LED1 on sheet [5]-BUTTONS_ILLUMINATION; Supplier 1: Digi-Key; Manufacturer Part Number 1: BL-HJXGXBX32N; Stock 1: 23855; Pricing 1: 1=0.59000, 10=0.42700, 100=0.27880, 500=0.20040, 1000=0.15683 (USD); RoHS: No; Packaging: Cut Tape; Supplier Part Number 1: BL-HJXGXBX32NCT-ND
R75-R86 = CRCW0603220RJNEA: RES SMD 220 OHM 5% 1/10W 0603; Manufacturer 1: Vishay; Power Rating: 100mW; Temperature Coefficient: 200ppm/°C; Voltage Rating: 75V; Supplier 1: Digi-Key; Manufacturer Part Number 1: CRCW0603220RJNEA; Stock 1: 284000; Pricing 1: 1=0.1, 10=0.031, 100=0.0125, 1000=0.00563, 2500=0.00488 (USD); Mount: Surface Mount; Case/Package: 0603; Weight: 7.1E-05oz; Case Code (Metric): 1608; Case Code (Imperial): 0603; Contact Plating: Tin; Min Operating Temperature: -55°C; Max Operating Temperature: 155°C; Resistance: 220R; Tolerance: 5%; Packaging: Tape and Reel; Composition: Thick Film; Package Quantity: 1; Number of Terminations: 2; Max Power Dissipation: 100mW; Military Standard: Not; Termination: SMD/SMT; Features: Automotive AEC-Q200; Working Voltage: 75V; Length: 1.55mm; Height: 0.45mm; Width: 0.033inch; Depth: 0.85mm; Radiation Hardening: No; REACH SVHC: Unknown; ComponentLink1URL: https://datasheet.ciiva.com/2524/dcrcwe3-2524384.pdf; ComponentLink1Description: https://datasheet.ciiva.com/2524/dcrcwe3-2524384.pdf; ComponentLink2URL: https://datasheet.ciiva.com/2524/dcrcwe3-2524385.pdf; ComponentLink2Description: https://datasheet.ciiva.com/2524/dcrcwe3-2524385.pdf; ComponentLink3URL: https://datasheet.ciiva.com/2524/dcrcwe3-2524386.pdf; ComponentLink3Description: https://datasheet.ciiva.com/2524/dcrcwe3-2524386.pdf; ComponentLink4URL: https://datasheet.ciiva.com/8339/dcrcwe3-8339958.pdf; ComponentLink4Description: https://datasheet.ciiva.com/8339/dcrcwe3-8339958.pdf; ComponentLink5URL: https://datasheet.ciiva.com/22869/70201119-22869142.pdf; ComponentLink5Description: https://datasheet.ciiva.com/22869/70201119-22869142.pdf; ComponentLink6URL: https://datasheet.ciiva.com/46448/1807946-46448601.pdf; ComponentLink6Description: https://datasheet.ciiva.com/46448/1807946-46448601.pdf; ComponentLink7URL: https://datasheet.ciiva.com/5550/dcrcwe3-109170-5550730.pdf; ComponentLink7Description: https://datasheet.ciiva.com/5550/dcrcwe3-109170-5550730.pdf; Supplier Part Number 1: 541-220GCT-ND
U4 = IC_PCA9685BS,118: IC LED DRVR LIN DIM 25MA 28HVQFN; Manufacturer 1: NXP Semiconductors; Number of Outputs: 16; Frequency: 50MHz; Output Voltage: 5.5V; Supplier 1: Digi-Key; Manufacturer Part Number 1: PCA9685BS,118; Stock 1: 4307; Pricing 1: 1=2.46, 10=2.205, 100=1.7727, 500=1.45642, 1000=1.20675 (USD); Mount: Surface Mount; Case/Package: VQFN; Number of Pins: 28; Contact Plating: Gold; Min Operating Temperature: -40°C; Max Operating Temperature: 85°C; Packaging: Tape and Reel; Package Quantity: 1; Radiation Hardening: No; ComponentLink1URL: https://datasheet.ciiva.com/12278/pca9685-62190-12278354.pdf; ComponentLink1Description: https://datasheet.ciiva.com/12278/pca9685-62190-12278354.pdf; ComponentLink2URL: https://datasheet.ciiva.com/8125/pca9685-8125351.pdf; ComponentLink2Description: https://datasheet.ciiva.com/8125/pca9685-8125351.pdf; ComponentLink3URL: https://datasheet.ciiva.com/1945/pca9685-1945099.pdf; ComponentLink3Description: https://datasheet.ciiva.com/1945/pca9685-1945099.pdf; ComponentLink4URL: https://datasheet.ciiva.com/1945/pca9685-1945100.pdf; ComponentLink4Description: https://datasheet.ciiva.com/1945/pca9685-1945100.pdf; ComponentLink5URL: https://datasheet.ciiva.com/1945/pca9685-1945101.pdf; ComponentLink5Description: https://datasheet.ciiva.com/1945/pca9685-1945101.pdf; Supplier Part Number 1: 568-5305-1-ND

## Nets that join several sheets
+3V3: [1]-PWR_12VIN (C2.1 C4.2 U1.2), [2]-MCU_LPC1778FBD144 (32 pins), [3]-GLCD_128X64 (C19.1 C20.1 P5.14 P6.1), [4]-MECH_BUTTONS (16 pins), [6]-PEAKMETER_LEDS (C30.1 U4.25 U4.26)
+12V: [1]-PWR_12VIN (C1.2 C3.2 TP1.1 U1.3), [2]-MCU_LPC1778FBD144 (5 pins), [5]-BUTTONS_ILLUMINATION (21 pins)
GND: [1]-PWR_12VIN (5 pins), [2]-MCU_LPC1778FBD144 (40 pins), [3]-GLCD_128X64 (10 pins), [4]-MECH_BUTTONS (23 pins), [5]-BUTTONS_ILLUMINATION (42 pins), [6]-PEAKMETER_LEDS (21 pins)
B1_LED_B: [2]-MCU_LPC1778FBD144 (U2.80), [5]-BUTTONS_ILLUMINATION (Q7.1 R43.1)
B1_LED_G: [2]-MCU_LPC1778FBD144 (U2.75), [5]-BUTTONS_ILLUMINATION (Q5.1 R41.1)
B1_LED_R: [2]-MCU_LPC1778FBD144 (U2.74), [5]-BUTTONS_ILLUMINATION (Q3.1 R33.1)
B2_LED_B: [2]-MCU_LPC1778FBD144 (U2.71), [5]-BUTTONS_ILLUMINATION (Q13.1 R55.1)
B2_LED_G: [2]-MCU_LPC1778FBD144 (U2.70), [5]-BUTTONS_ILLUMINATION (Q11.1 R53.1)
B2_LED_R: [2]-MCU_LPC1778FBD144 (U2.69), [5]-BUTTONS_ILLUMINATION (Q9.1 R45.1)
B3_LED_B: [2]-MCU_LPC1778FBD144 (U2.61), [5]-BUTTONS_ILLUMINATION (Q19.1 R67.1)
B3_LED_G: [2]-MCU_LPC1778FBD144 (U2.57), [5]-BUTTONS_ILLUMINATION (Q17.1 R65.1)
B3_LED_R: [2]-MCU_LPC1778FBD144 (U2.56), [5]-BUTTONS_ILLUMINATION (Q15.1 R57.1)
BUTTON_1: [2]-MCU_LPC1778FBD144 (U2.73), [4]-MECH_BUTTONS (R29.1 SW1.3 SW1.4)
BUTTON_2: [2]-MCU_LPC1778FBD144 (U2.68), [4]-MECH_BUTTONS (R30.1 SW2.3 SW2.4)
BUTTON_3: [2]-MCU_LPC1778FBD144 (U2.55), [4]-MECH_BUTTONS (R31.1 SW3.3 SW3.4)
BUTTON_MOD: [2]-MCU_LPC1778FBD144 (U2.136), [4]-MECH_BUTTONS (R32.1 SW4.3 SW4.4)
ENC1_A: [2]-MCU_LPC1778FBD144 (U2.97), [4]-MECH_BUTTONS (R25.1)
ENC1_B: [2]-MCU_LPC1778FBD144 (U2.99), [4]-MECH_BUTTONS (R19.1)
ENC1_SW: [2]-MCU_LPC1778FBD144 (U2.96), [4]-MECH_BUTTONS (E1.2 R12.1)
ENC2_A: [2]-MCU_LPC1778FBD144 (U2.107), [4]-MECH_BUTTONS (R26.1)
ENC2_B: [2]-MCU_LPC1778FBD144 (U2.106), [4]-MECH_BUTTONS (R20.1)
ENC2_SW: [2]-MCU_LPC1778FBD144 (U2.105), [4]-MECH_BUTTONS (E2.2 R13.1)
ENC3_A: [2]-MCU_LPC1778FBD144 (U2.113), [4]-MECH_BUTTONS (R27.1)
ENC3_B: [2]-MCU_LPC1778FBD144 (U2.112), [4]-MECH_BUTTONS (R21.1)
ENC3_SW: [2]-MCU_LPC1778FBD144 (U2.111), [4]-MECH_BUTTONS (E3.2 R14.1)
FS1: [2]-MCU_LPC1778FBD144 (U2.30), [4]-MECH_BUTTONS (P4.2 R28.2)
FS1_LED_B: [2]-MCU_LPC1778FBD144 (U2.36), [5]-BUTTONS_ILLUMINATION (Q8.1 R44.1)
FS1_LED_G: [2]-MCU_LPC1778FBD144 (U2.29), [5]-BUTTONS_ILLUMINATION (Q6.1 R42.1)
FS1_LED_R: [2]-MCU_LPC1778FBD144 (U2.32), [5]-BUTTONS_ILLUMINATION (Q4.1 R37.1)
FS2: [2]-MCU_LPC1778FBD144 (U2.46), [4]-MECH_BUTTONS (P3.2 R15.2)
FS2_LED_B: [2]-MCU_LPC1778FBD144 (U2.47), [5]-BUTTONS_ILLUMINATION (Q14.1 R56.1)
FS2_LED_G: [2]-MCU_LPC1778FBD144 (U2.49), [5]-BUTTONS_ILLUMINATION (Q12.1 R54.1)
FS2_LED_R: [2]-MCU_LPC1778FBD144 (U2.50), [5]-BUTTONS_ILLUMINATION (Q10.1 R49.1)
FS3: [2]-MCU_LPC1778FBD144 (U2.52), [4]-MECH_BUTTONS (P2.2 R11.2)
FS3_LED_B: [2]-MCU_LPC1778FBD144 (U2.51), [5]-BUTTONS_ILLUMINATION (Q20.1 R68.1)
FS3_LED_G: [2]-MCU_LPC1778FBD144 (U2.53), [5]-BUTTONS_ILLUMINATION (Q18.1 R66.1)
FS3_LED_R: [2]-MCU_LPC1778FBD144 (U2.54), [5]-BUTTONS_ILLUMINATION (Q16.1 R61.1)
GLCD1_BL: [2]-MCU_LPC1778FBD144 (U2.45), [3]-GLCD_128X64 (Q2.1)
GLCD1_CS: [2]-MCU_LPC1778FBD144 (U2.110), [3]-GLCD_128X64 (P5.1)
GLCD1_RESET: [2]-MCU_LPC1778FBD144 (U2.108), [3]-GLCD_128X64 (P5.2)
GLCD_A0: [2]-MCU_LPC1778FBD144 (U2.40), [3]-GLCD_128X64 (P5.3)
GLCD_D0: [2]-MCU_LPC1778FBD144 (U2.137), [3]-GLCD_128X64 (P5.6)
GLCD_D1: [2]-MCU_LPC1778FBD144 (U2.140), [3]-GLCD_128X64 (P5.7)
GLCD_D2: [2]-MCU_LPC1778FBD144 (U2.144), [3]-GLCD_128X64 (P5.8)
GLCD_D3: [2]-MCU_LPC1778FBD144 (U2.2), [3]-GLCD_128X64 (P5.9)
GLCD_D4: [2]-MCU_LPC1778FBD144 (U2.9), [3]-GLCD_128X64 (P5.10)
GLCD_D5: [2]-MCU_LPC1778FBD144 (U2.12), [3]-GLCD_128X64 (P5.11)
GLCD_D6: [2]-MCU_LPC1778FBD144 (U2.16), [3]-GLCD_128X64 (P5.12)
GLCD_D7: [2]-MCU_LPC1778FBD144 (U2.19), [3]-GLCD_128X64 (P5.13)
GLCD_RD: [2]-MCU_LPC1778FBD144 (U2.39), [3]-GLCD_128X64 (P5.4)
GLCD_RW: [2]-MCU_LPC1778FBD144 (U2.38), [3]-GLCD_128X64 (P5.5)
MB_LED_B: [2]-MCU_LPC1778FBD144 (U2.143), [5]-BUTTONS_ILLUMINATION (Q23.1 R74.1)
MB_LED_G: [2]-MCU_LPC1778FBD144 (U2.135), [5]-BUTTONS_ILLUMINATION (Q22.1 R73.1)
MB_LED_R: [2]-MCU_LPC1778FBD144 (U2.134), [5]-BUTTONS_ILLUMINATION (Q21.1 R69.1)
PM_LEDS_OE: [2]-MCU_LPC1778FBD144 (P1.6 R6.1), [6]-PEAKMETER_LEDS (U4.20)
PM_LEDS_SCL: [2]-MCU_LPC1778FBD144 (P1.7 R8.1), [6]-PEAKMETER_LEDS (U4.23)
PM_LEDS_SDA: [2]-MCU_LPC1778FBD144 (P1.8 R7.1), [6]-PEAKMETER_LEDS (U4.24)